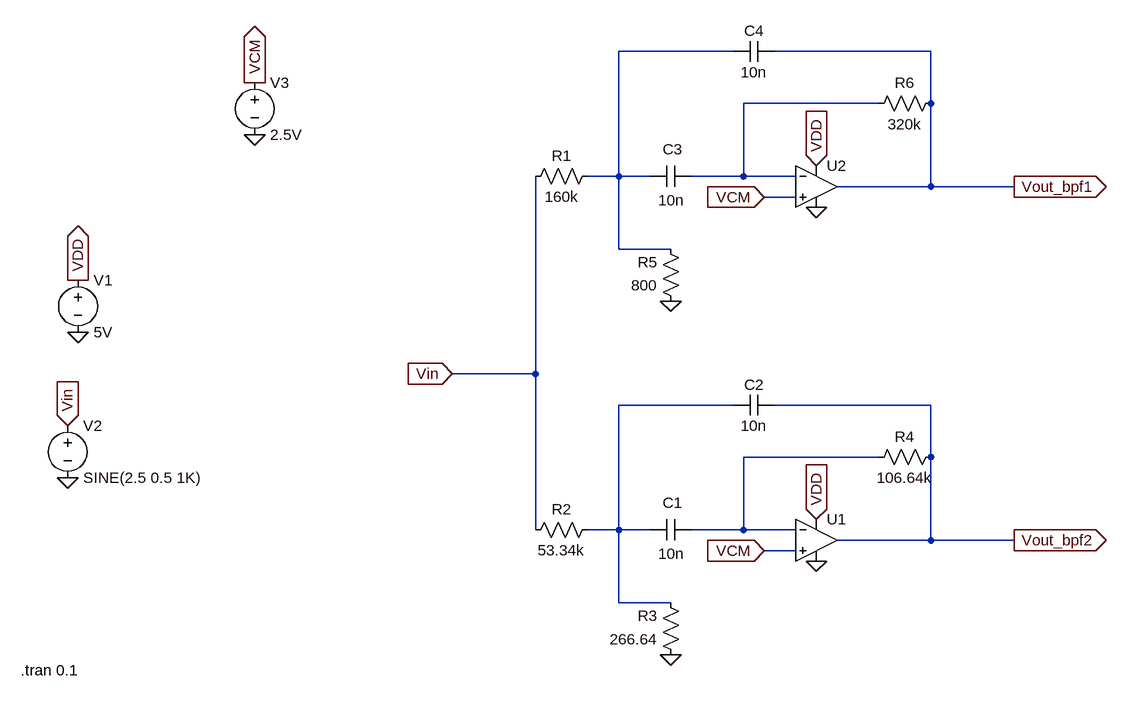
[diagram p0: schematic Exp_6[1].asc]
Exp_6[1].asc, the LTspice schematic file:
Version 4
SHEET 1 980 688
WIRE 368 -336 192 -336
WIRE 672 -336 432 -336
WIRE 592 -256 384 -256
WIRE 672 -256 672 -336
WIRE 192 -144 192 -336
WIRE 192 -144 144 -144
WIRE 240 -144 192 -144
WIRE 384 -144 384 -256
WIRE 384 -144 304 -144
WIRE 464 -144 384 -144
WIRE 672 -128 672 -256
WIRE 672 -128 528 -128
WIRE 800 -128 672 -128
WIRE 464 -112 416 -112
WIRE 192 -32 192 -144
WIRE 272 -32 192 -32
WIRE 64 160 64 -144
WIRE 64 160 -64 160
WIRE 368 208 192 208
WIRE 672 208 432 208
WIRE 592 288 384 288
WIRE 672 288 672 208
WIRE 64 400 64 160
WIRE 192 400 192 208
WIRE 192 400 144 400
WIRE 240 400 192 400
WIRE 384 400 384 288
WIRE 384 400 304 400
WIRE 464 400 384 400
WIRE 672 416 672 288
WIRE 672 416 528 416
WIRE 800 416 672 416
WIRE 464 432 416 432
WIRE 192 512 192 400
WIRE 272 512 192 512
FLAG -64 160 Vin
IOPIN -64 160 In
FLAG 272 592 0
FLAG 416 432 VCM
IOPIN 416 432 In
FLAG 272 48 0
FLAG 416 -112 VCM
IOPIN 416 -112 In
FLAG 496 -96 0
FLAG 496 448 0
FLAG 496 384 VDD
IOPIN 496 384 In
FLAG 496 -160 VDD
IOPIN 496 -160 In
FLAG 800 -128 Vout_bpf1
IOPIN 800 -128 Out
FLAG 800 416 Vout_bpf2
IOPIN 800 416 Out
FLAG -640 96 0
FLAG -656 320 0
FLAG -368 -208 0
FLAG -368 -288 VCM
IOPIN -368 -288 Out
FLAG -640 16 VDD
IOPIN -640 16 Out
FLAG -656 240 Vin
IOPIN -656 240 In
SYMBOL res 160 -160 R90
WINDOW 0 0 56 VBottom 2
WINDOW 3 32 56 VTop 2
SYMATTR InstName R1
SYMATTR Value 160k
SYMBOL res 160 384 R90
WINDOW 0 0 56 VBottom 2
WINDOW 3 32 56 VTop 2
SYMATTR InstName R2
SYMATTR Value 53.34k
SYMBOL res 288 608 R180
WINDOW 0 36 76 Left 2
WINDOW 3 36 40 Left 2
SYMATTR InstName R3
SYMATTR Value 266.64
SYMBOL cap 304 384 R90
WINDOW 0 -10 29 VBottom 2
WINDOW 3 37 31 VTop 2
SYMATTR InstName C1
SYMATTR Value 10n
SYMBOL cap 432 192 R90
WINDOW 0 0 32 VBottom 2
WINDOW 3 32 32 VTop 2
SYMATTR InstName C2
SYMATTR Value 10n
SYMBOL OpAmps\\UniversalOpAmp 496 416 R0
SYMATTR InstName U1
SYMBOL res 688 272 R90
WINDOW 0 0 56 VBottom 2
WINDOW 3 32 56 VTop 2
SYMATTR InstName R4
SYMATTR Value 106.64k
SYMBOL res 288 64 R180
WINDOW 0 36 76 Left 2
WINDOW 3 36 40 Left 2
SYMATTR InstName R5
SYMATTR Value 800
SYMBOL cap 304 -160 R90
WINDOW 0 -10 29 VBottom 2
WINDOW 3 37 31 VTop 2
SYMATTR InstName C3
SYMATTR Value 10n
SYMBOL cap 432 -352 R90
WINDOW 0 0 32 VBottom 2
WINDOW 3 32 32 VTop 2
SYMATTR InstName C4
SYMATTR Value 10n
SYMBOL OpAmps\\UniversalOpAmp 496 -128 R0
SYMATTR InstName U2
SYMBOL res 688 -272 R90
WINDOW 0 0 56 VBottom 2
WINDOW 3 32 56 VTop 2
SYMATTR InstName R6
SYMATTR Value 320k
SYMBOL voltage -640 0 R0
WINDOW 123 0 0 Left 0
WINDOW 39 0 0 Left 0
SYMATTR InstName V1
SYMATTR Value 5V
SYMBOL voltage -656 224 R0
WINDOW 123 0 0 Left 0
WINDOW 39 0 0 Left 0
SYMATTR InstName V2
SYMATTR Value SINE(2.5 0.5 1K)
SYMBOL voltage -368 -304 R0
WINDOW 123 0 0 Left 0
WINDOW 39 0 0 Left 0
SYMATTR InstName V3
SYMATTR Value 2.5V
TEXT -728 616 Left 2 !.tran 0.1

The netlist it stands for:
* Exp_6[1].asc
R1 N001 Vin 160k
R2 N003 Vin 53.34k
R3 0 N003 266.64
C1 N004 N003 10n
C2 Vout_bpf2 N003 10n
XU1 VCM N004 VDD 0 Vout_bpf2 level1 Avol=1Meg GBW=10Meg Vos=0 En=0 Enk=0 In=0 Ink=0 Rin=500Meg  ; pins In+ In- V+ V- OUT
R4 Vout_bpf2 N004 106.64k
R5 0 N001 800
C3 N002 N001 10n
C4 Vout_bpf1 N001 10n
XU2 VCM N002 VDD 0 Vout_bpf1 level1 Avol=1Meg GBW=10Meg Vos=0 En=0 Enk=0 In=0 Ink=0 Rin=500Meg  ; pins In+ In- V+ V- OUT
R6 Vout_bpf1 N002 320k
V1 VDD 0 5V
V2 Vin 0 SINE(2.5 0.5 1K)
V3 VCM 0 2.5V
.tran 0.1
.lib UniversalOpAmp1.lib
.backanno
.end